# Altium schematic sheet Connector.SchDoc
size A4; SheetNumber: 2; SheetTotal: 2
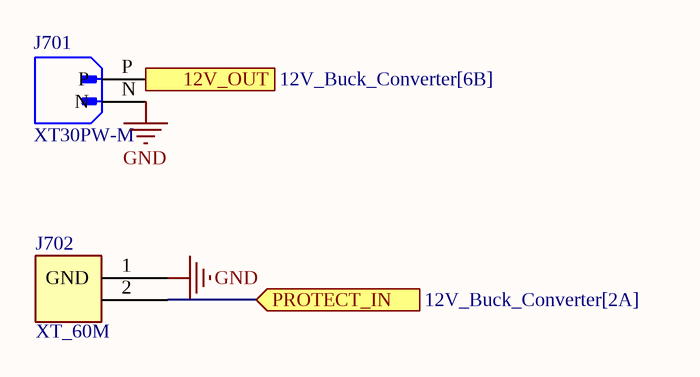
[diagram p0: Connector.SchDoc]

## Parts
J701  XT30PW-M  [AMASS_XT30PW-M]
J702  XT_60M  [XT60_M]

## Ports
12V_OUT (out, see 12V_Buck_Converter[6B]), PROTECT_IN (in, see 12V_Buck_Converter[2A])

## Nets
GND: J701.N J702.1(GND)
12V_OUT: J701.P ; port 12V_OUT
PROTECT_IN: J702.2 ; port PROTECT_IN

## Library data of the parts
J701 = CMP-019-000079-2: Socket; DC supply; XT30; male; PIN: 2; on PCBs; THT; Colour: yellow; System: Connector; MF: AMASS; Check_prices: https://www.snapeda.com/parts/XT30PW-M/AMASS/view-part/?ref=eda; Source: XT30PW-M.SchLib; Pin Count: 2; Value: *; Package: None; Component Type: Standard; SnapEDA_Link: https://www.snapeda.com/parts/XT30PW-M/AMASS/view-part/?ref=snap; MP: XT30PW-M; Design Item ID: XT30PW-M
J702 = CMP-019-000042-2: XT_60 Connector MALE; Design Item ID: XT_60M; Source: robit_connector.SchLib; System: Connector